# Altium schematic sheet PowerSupply.SchDoc
size A4
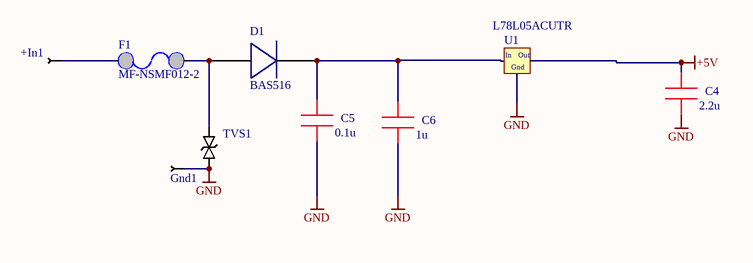
[diagram p0: PowerSupply.SchDoc]

## Parts
+In1  PIN_Wire  [PIN_wire]  (value not drawn)
C4  2.2u  [0603]
C5  0.1u  [0805]
C6  1u  [0603]
D1  BAS516  [SOD523]
F1  MF-NSMF012-2  [FUSE MF12]
Gnd1  PIN_Wire  [PIN_wire]  (value not drawn)
TVS1  SMAJ5.0CA  [DO-214AC]  (value not drawn)
U1  L78L05ACUTR

## Nets
+5V: C4.2 U1.1(OUT)
GND: C4.1 C5.1 C6.1 Gnd1.0 TVS1.1 U1.2(GND)
Net+In1_0: +In1.0 F1.1
NetC5_2: C5.2 C6.2 D1.1 U1.3(IN)
NetD1_2: D1.2 F1.0 TVS1.2

## Notes on the sheet
- (in symbol LDO_SOT89) In; Out; Gnd

## Library data of the parts
+In1 Gnd1 = PIN_Wire: pin
C4 = Capasitor 0805: GRM188R61E225KA12D
C5 = Capasitor 0805: CC0805KRX7R9BB104
C6 = Capasitor 0805: CC0603KRX7R9BB105
F1 = Fuse PTS
TVS1 = SMAJ5.0CA: SMAJ30CA
U1 = LDO_SOT89: SOT-89